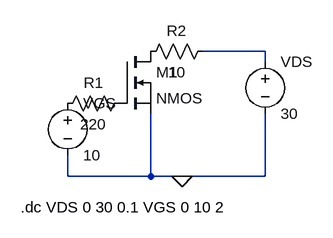
[diagram p0: schematic (12)VI chracteristic of mosfet.asc]
(12)VI chracteristic of mosfet.asc, the LTspice schematic file:
Version 4
SHEET 1 880 680
WIRE 416 112 320 112
WIRE 416 128 416 112
WIRE 112 304 112 272
WIRE 240 304 240 208
WIRE 240 304 112 304
WIRE 288 304 240 304
WIRE 416 304 416 208
WIRE 416 304 288 304
FLAG 288 304 0
SYMBOL nmos 192 112 R0
SYMATTR InstName M1
SYMBOL res 208 176 R90
WINDOW 0 0 56 VBottom 2
WINDOW 3 32 56 VTop 2
SYMATTR InstName R1
SYMATTR Value 220
SYMBOL voltage 112 176 R0
WINDOW 123 0 0 Left 0
WINDOW 39 0 0 Left 0
SYMATTR InstName VGS
SYMATTR Value 10
SYMBOL res 336 96 R90
WINDOW 0 0 56 VBottom 2
WINDOW 3 32 56 VTop 2
SYMATTR InstName R2
SYMATTR Value 10
SYMBOL voltage 416 112 R0
WINDOW 123 0 0 Left 0
WINDOW 39 0 0 Left 0
SYMATTR InstName VDS
SYMATTR Value 30
TEXT 40 352 Left 2 !.dc VDS 0 30 0.1 VGS 0 10 2

The netlist it stands for:
* (12)VI chracteristic of mosfet.asc
M1 P001 P002 0 0 NMOS
R1 P002 P003 220
VGS P003 0 10
R2 N001 P001 10
VDS N001 0 30
.model NMOS NMOS
.model PMOS PMOS
.lib standard.mos
.dc VDS 0 30 0.1 VGS 0 10 2
.backanno
.end